# EAGLE design MagicDesk (EAGLE 7.1.0)
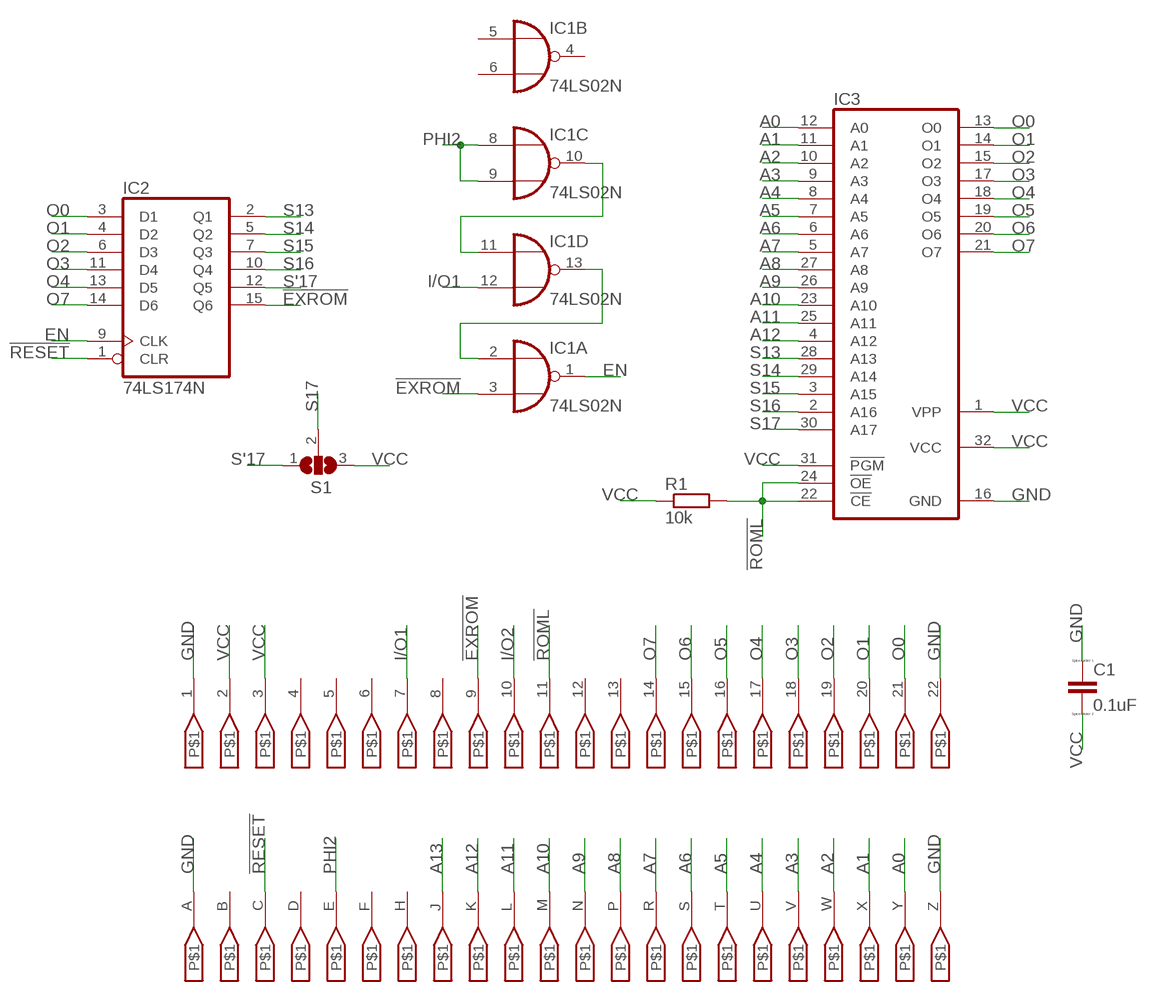
[diagram p0: schematic, sheet 1]

## Parts
C1  0.1uF  C-EU050-24X044_SP  [C050-24X044_SP]
IC1  74LS02N  [DIL14]
IC2  74LS174N  [DIL16]
IC3  27C2001D  [DIL32]
R1  10k  R-EU_0207/10_SP  [0207/10_SP]
S1  SJ2W_NUMBERED  [SJ_2_NUM]
U$1  C64_EXPANSION_FINGERS_PIN8X1.9  [C64_EXPANSION_FINGERS_THINNER]

## Nets
!EXROM: IC1.3(A:I1) IC2.15(Q6) U$1.9
!RESET: IC2.1(CLR) U$1.C
!ROML: IC3.22(!CE) IC3.24(!OE) R1.2 U$1.11
A0: IC3.12(A0) U$1.Y
A1: IC3.11(A1) U$1.X
A2: IC3.10(A2) U$1.W
A3: IC3.9(A3) U$1.V
A4: IC3.8(A4) U$1.U
A5: IC3.7(A5) U$1.T
A6: IC3.6(A6) U$1.S
A7: IC3.5(A7) U$1.R
A8: IC3.27(A8) U$1.P
A9: IC3.26(A9) U$1.N
A10: IC3.23(A10) U$1.M
A11: IC3.25(A11) U$1.L
A12: IC3.4(A12) U$1.K
A13: U$1.J
EN: IC1.1(A:O) IC2.9(CLK)
GND: C1.1 IC3.16(GND) U$1.1 U$1.22 U$1.A U$1.Z
I/O1: IC1.12(D:I1) U$1.7
I/O2: U$1.10
N$1: IC1.2(A:I0) IC1.13(D:O)
N$3: IC1.10(C:O) IC1.11(D:I0)
O0: IC2.3(D1) IC3.13(O0) U$1.21
O1: IC2.4(D2) IC3.14(O1) U$1.20
O2: IC2.6(D3) IC3.15(O2) U$1.19
O3: IC2.11(D4) IC3.17(O3) U$1.18
O4: IC2.13(D5) IC3.18(O4) U$1.17
O5: IC3.19(O5) U$1.16
O6: IC3.20(O6) U$1.15
O7: IC2.14(D6) IC3.21(O7) U$1.14
PHI2: IC1.8(C:I0) IC1.9(C:I1) U$1.E
S13: IC2.2(Q1) IC3.28(A13)
S14: IC2.5(Q2) IC3.29(A14)
S15: IC2.7(Q3) IC3.3(A15)
S16: IC2.10(Q4) IC3.2(A16)
S17: IC3.30(A17) S1.2
S'17: IC2.12(Q5) S1.1
VCC: C1.2 IC3.1(VPP) IC3.31(!PGM) IC3.32(VCC) R1.1 S1.3 U$1.2 U$1.3
Unconnected: IC1.4(B:O) IC1.5(B:I0) IC1.6(B:I1) U$1.4 U$1.5 U$1.6 U$1.8 U$1.12 U$1.13 U$1.B U$1.D U$1.F U$1.H

## Power pins joined to a net without a drawn wire
GND: IC1.7(P:GND) IC2.8(GND)
VCC: IC1.14(P:VCC) IC2.16(VCC)

## Library data of the parts
C1 = MyCustomLibrary:C-EU: CAPACITOR, European symbol
IC1 = MyCustomLibrary:74*02: Quad 2-input NOR gate
IC2 = MyCustomLibrary:74*174: Hex D type FLIP FLOP, clear
IC3 = MyCustomLibrary:27C2001D: MEMORY; MPN: M27C2001-10B1; OC_FARNELL: 3338101; OC_NEWARK: 37M4702
R1 = MyCustomLibrary:R-EU_: RESISTOR, European symbol
S1 = MyCustomLibrary:SJ2W: SMD solder JUMPER
U$1 = MyCustomLibrary:C64_EXPANSION_FINGERS_PIN

## Board
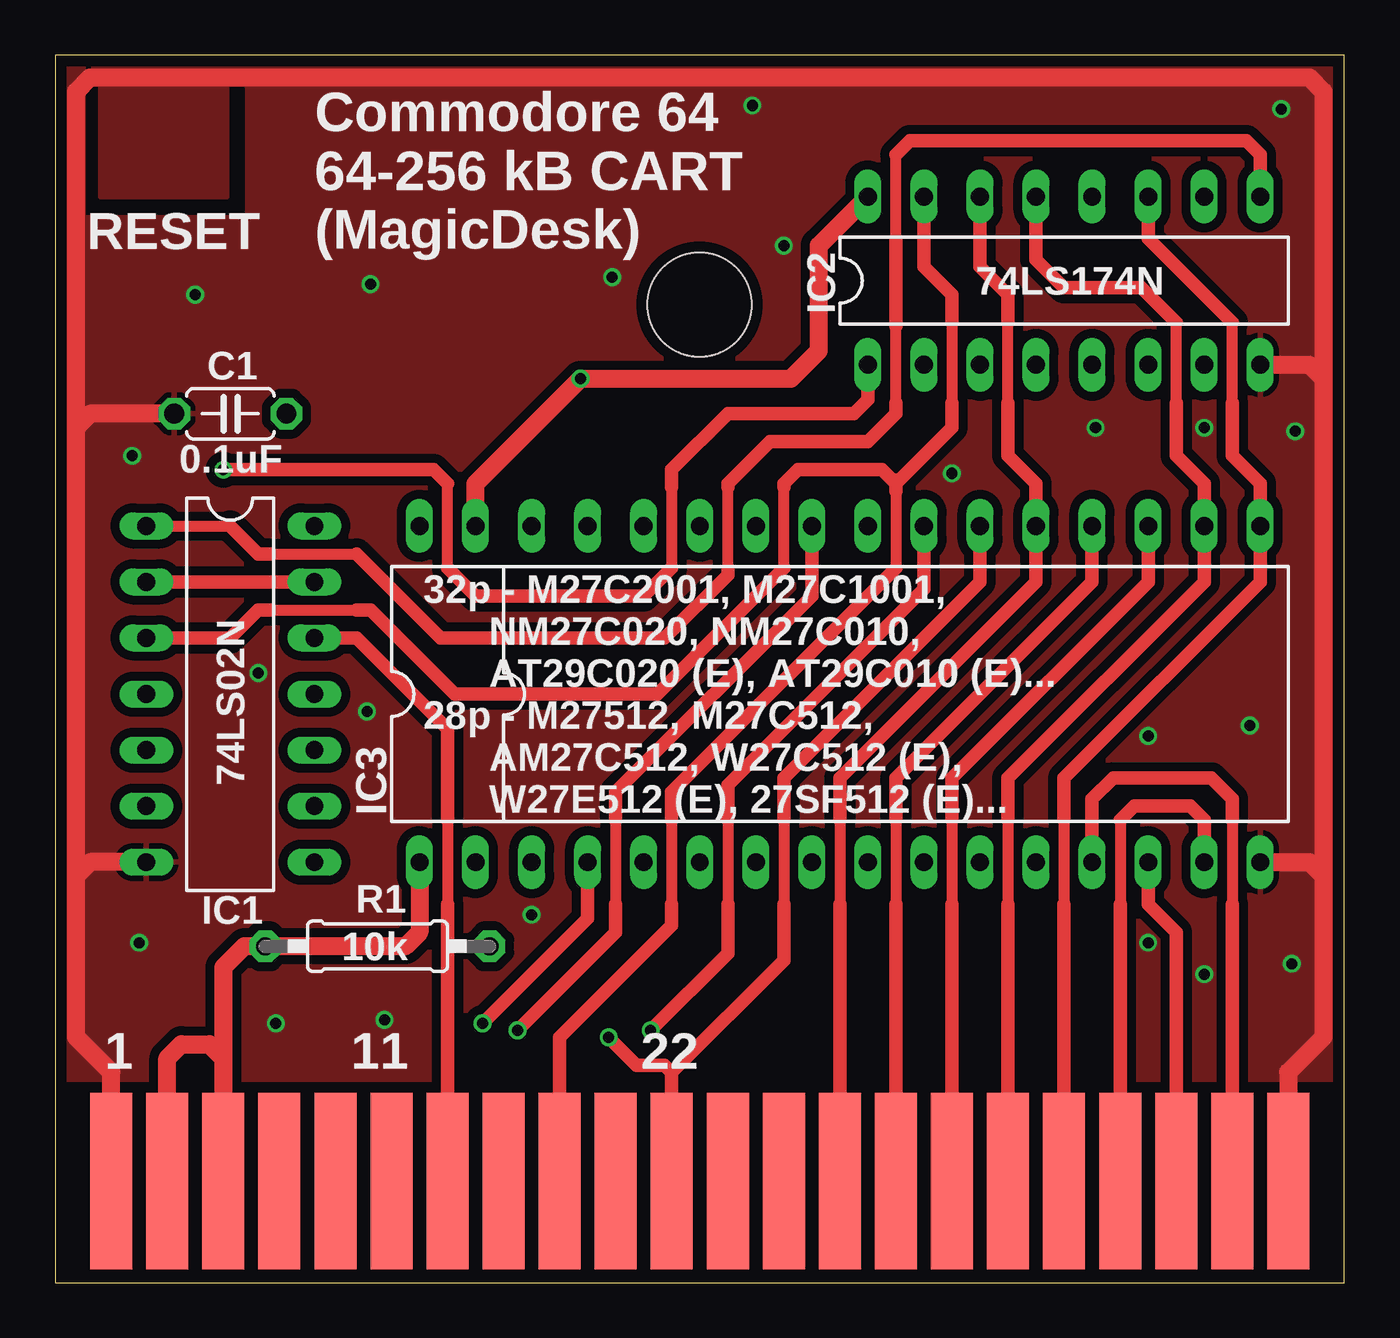
[diagram p1: board, top side]
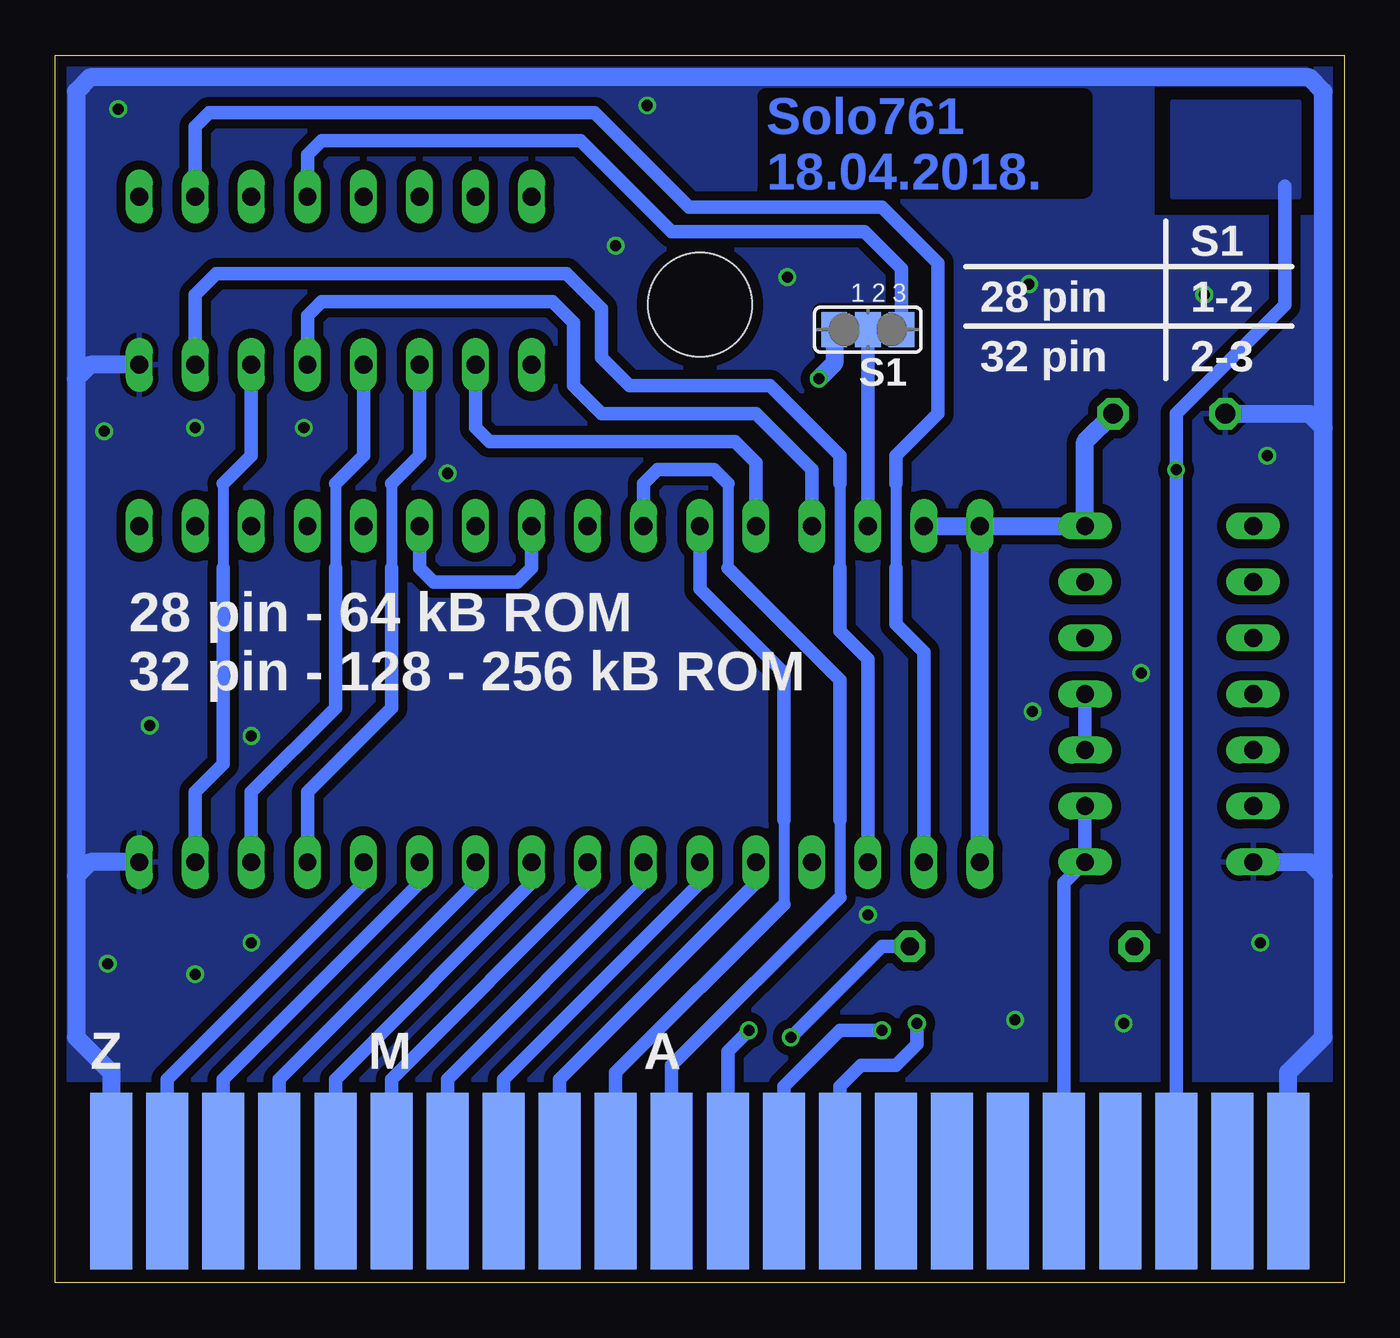
[diagram p2: board, bottom side, seen from below]

Size 58.42 x 55.62 mm. Coordinates in mm from the lower left corner, seen from the top.
Outline: 0,0 58.42,0 58.42,55.62 0,55.62 0,0
Copper layers (1*16): Top 0.035mm / dielectric 1.6mm / Bottom 0.035mm
Design rules "Custom_Elecrow_2-layer_PCB_eagle_rule": minimum track width 6mil, minimum drill 12mil, track to track 16mil, track to pad 16mil, pad to pad 12mil, via to via 12mil, smd to smd 0mil, copper to edge 20mil, drill to drill 10mil, minimum pad ring 6mil, minimum via ring 6mil, stop-mask expansion 0mil, vias tented up to drill 100mil, thermal gap 10mil
Holes 4.7 mm at 29.2,44.31

### Footprints (pad centres in the part's own frame; a part is rotated, then mirrored left to right if it is on the bottom)
C050-24X044_SP = drill 0.9 pad 1.422 octagon: 1 -2.54,0; 2 2.54,0
DIL14 = drill 0.813 long: 1 -7.62,-3.81; 2 -5.08,-3.81; 3 -2.54,-3.81; 4 0,-3.81; 5 2.54,-3.81; 6 5.08,-3.81; 7 7.62,-3.81; 8 7.62,3.81; 9 5.08,3.81; 10 2.54,3.81; 11 0,3.81; 12 -2.54,3.81; 13 -5.08,3.81; 14 -7.62,3.81
DIL16 = drill 0.813 long: 1 -8.89,-3.81; 2 -6.35,-3.81; 3 -3.81,-3.81; 4 -1.27,-3.81; 5 1.27,-3.81; 6 3.81,-3.81; 7 6.35,-3.81; 8 8.89,-3.81; 9 8.89,3.81; 10 6.35,3.81; 11 3.81,3.81; 12 1.27,3.81; 13 -1.27,3.81; 14 -3.81,3.81; 15 -6.35,3.81; 16 -8.89,3.81
DIL32 = drill 0.813 long: 1 -19.05,-7.62; 2 -16.51,-7.62; 3 -13.97,-7.62; 4 -11.43,-7.62; 5 -8.89,-7.62; 6 -6.35,-7.62; 7 -3.81,-7.62; 8 -1.27,-7.62; 9 1.27,-7.62; 10 3.81,-7.62; 11 6.35,-7.62; 12 8.89,-7.62; 13 11.43,-7.62; 14 13.97,-7.62; 15 16.51,-7.62; 16 19.05,-7.62; 17 19.05,7.62; 18 16.51,7.62; 19 13.97,7.62; 20 11.43,7.62; 21 8.89,7.62; 22 6.35,7.62; 23 3.81,7.62; 24 1.27,7.62; 25 -1.27,7.62; 26 -3.81,7.62; 27 -6.35,7.62; 28 -8.89,7.62; 29 -11.43,7.62; 30 -13.97,7.62; 31 -16.51,7.62; 32 -19.05,7.62
0207/10_SP = drill 0.813 pad 1.422 octagon: 1 -5.08,0; 2 5.08,0
SJ_2_NUM = smd 1.168 x 1.6: 1 -1.524,0; 2 0,0; 3 1.524,0
C64_EXPANSION_FINGERS_THINNER = smd 1.9 x 8: 1 -25.4,0; 2 -22.86,0; 3 -20.32,0; 4 -17.78,0; 5 -15.24,0; 6 -12.7,0; 7 -10.16,0; 8 -7.62,0; 9 -5.08,0; 10 -2.54,0; 11 0,0; 12 2.54,0; 13 5.08,0; 14 7.62,0; 15 10.16,0; 16 12.7,0; 17 15.24,0; 18 17.78,0; 19 20.32,0; 20 22.86,0; 21 25.4,0; 22 27.94,0 | smd 1.9 x 8 bottom: A -25.4,0; B -22.86,0; C -20.32,0; D -17.78,0; E -15.24,0; F -12.7,0; H -10.16,0; J -7.62,0; K -5.08,0; L -2.54,0; M 0,0; N 2.54,0; P 5.08,0; R 7.62,0; S 10.16,0; T 12.7,0; U 15.24,0; V 17.78,0; W 20.32,0; X 22.86,0; Y 25.4,0; Z 27.94,0

### Placement (x,y rotation side)
C1  7.94,39.37 0 top
IC1  7.94,26.67 270 top
IC2  45.72,45.4 0 top
IC3  35.56,26.67 0 top
R1  14.61,15.24 0 top
S1  21.59,43.18 180 bottom
U$1  27.94,4.6 0 top
U$2  [COMMODORE_SIGN]  18.41,41.59 0 top

### Tracks (layer width: path | path; a pad name or v marks a point on that pad's centre or on a via)
!EXROM
  Top 0.508: 40.64,44.77 40.64,44.61 | 40.64,43.5 40.64,39.85 | 40.64,38.89 40.64,38.73 | 38.1,36.2 38.1,35.88 38.1,32.38 | 27.94,20.95 27.94,17.14 | 27.94,16.35 27.94,16.19 | 9.84,30.48 13.65,30.48 | 33.02,32.38 33.02,36.04
  Top 0.61: IC2.15 39.37,46.04 40.64,44.77 | 40.64,38.73 38.1,36.2 37.47,36.83 33.66,36.83 33.02,36.2 33.02,36.04 | 38.1,32.38 27.94,22.23 27.94,20.95 | 27.94,16.19 22.86,11.11 U$1.9 | IC1.3 7.94,29.21 9.21,30.48 9.84,30.48 | 33.02,32.38 27.3,26.67 18.1,26.67 14.29,30.48 13.65,30.48 | 27.94,16.35 27.94,17.14 | 38.1,36.35 38.1,35.88 | 40.64,44.61 40.64,43.5 | 40.64,38.89 40.64,39.85
!RESET  (via drill 0.5)
  Top 0.508: 27.94,36.2 27.94,36.04 27.94,32.38 | 17.78,32.38 17.78,36.2
  Top 0.61: IC2.1 36.83,40.01 36.2,39.37 30.48,39.37 27.94,36.83 27.94,36.67 | 27.94,32.38 26.67,31.11 19.05,31.11 17.78,32.38 | 17.78,36.2 17.14,36.83 v7.62,36.83 | 27.94,36.67 27.94,36.2 | 27.94,36.67 27.94,36.04
  Bottom 0.61: U$1.C v7.62,36.83 7.62,39.37 2.7,44.29 2.7,49.69
  pour Bottom: 2.06,53.5 2.06,49.21 7.78,49.21 7.78,53.5
!ROML  (via drill 0.5)
  Top 0.508: 33.02,20.95 33.02,17.14
  Top 0.61: IC3.22 41.91,31.75 33.02,22.86 33.02,20.95 | 27.94,9.53 33.02,14.61 33.02,17.14 | 27.94,9.53 U$1.11 | 27.94,9.53 27.62,9.84 26.35,9.84 v25.08,11.11
  Bottom 0.61: IC3.22 41.91,32.38 41.27,31.75 37.47,31.75 36.83,32.38 IC3.24 | v25.08,11.11 20.95,15.24 R1.2
A0
  Bottom 0.61: IC3.12 44.45,18.1 53.34,9.21 U$1.Y
A1
  Bottom 0.61: IC3.11 41.91,18.1 50.8,9.21 U$1.X
A2
  Bottom 0.61: IC3.10 39.37,18.1 48.26,9.21 U$1.W
A3
  Bottom 0.61: IC3.9 36.83,18.1 45.72,9.21 U$1.V
A4
  Bottom 0.61: IC3.8 34.29,18.1 43.18,9.21 U$1.U
A5
  Bottom 0.61: IC3.7 31.75,18.1 40.64,9.21 U$1.T
A6
  Bottom 0.61: IC3.6 29.21,18.1 38.1,9.21 U$1.S
A7
  Bottom 0.61: IC3.5 26.67,18.1 35.56,9.21 U$1.R
A8
  Bottom 0.508: 25.4,20.95 25.4,17.14
  Bottom 0.61: IC3.27 29.21,31.43 25.4,27.62 25.4,20.95 | 25.4,17.14 33.02,9.53 U$1.P
A9
  Bottom 0.508: 27.94,36.2 27.94,32.38 | 22.86,20.95 22.86,17.46
  Bottom 0.61: IC3.26 31.75,36.2 31.11,36.83 28.57,36.83 27.94,36.2 | 27.94,32.38 22.86,27.3 22.86,20.95 | 22.86,17.46 30.48,9.84 U$1.N
A10  (via drill 0.5)
  Top 0.508: 30.48,20.95 30.48,17.14
  Top 0.61: IC3.23 39.37,31.43 30.48,22.54 30.48,20.95 | v26.99,11.43 30.48,14.92 30.48,17.14
  Bottom 0.61: U$1.M 27.94,10.48 v26.99,11.43
A11  (via drill 0.5)
  Top 0.508: 25.4,20.95 25.4,17.14
  Top 0.61: IC3.25 34.29,31.11 25.4,22.23 25.4,20.95 | v20.95,11.43 25.4,15.88 25.4,16.99 25.4,17.14
  Bottom 0.61: U$1.L 25.4,8.89 22.86,11.43 v20.95,11.43
A12  (via drill 0.5)
  Top 0.61: IC3.4 24.13,16.51 v19.37,11.75
  Bottom 0.61: U$1.K 22.86,8.89 21.91,9.84 20.32,9.84 19.37,10.79 v19.37,11.75
EN
  Top 0.508: IC1.1 7.94,34.29 | 9.84,33.02 13.65,33.02 | 30.48,32.38 30.48,36.04 | 38.1,39.85 38.1,43.34 | 38.1,47.31 38.1,51.12
  Top 0.61: 7.94,34.29 9.21,33.02 9.84,33.02 | 13.65,33.02 17.46,29.21 27.62,29.21 30.48,32.07 30.48,32.38 | 38.1,51.12 38.73,51.75 53.98,51.75 54.61,51.12 IC2.9 | 30.48,36.04 30.48,36.2 32.38,38.1 36.83,38.1 38.1,39.37 38.1,39.85 | 38.1,43.34 38.1,47.31
GND  (via drill 0.5)
  Top 0.813: U$1.A 2.54,9.53 0.95,11.11 0.95,18.41 | 0.95,18.41 0.95,38.73 | 0.95,38.73 0.95,53.98 1.59,54.61 56.83,54.61 57.47,53.98 57.47,40.96 | 57.47,40.96 57.47,18.41 | 57.47,18.41 57.47,11.11 55.88,9.53 U$1.Z | IC3.16 56.83,19.05 57.47,18.41 | IC2.8 56.83,41.59 57.47,40.96 | IC1.7 1.59,19.05 0.95,18.41 | C1.1 1.59,39.37 0.95,38.73
  Bottom 0.813: U$1.A 2.54,9.53 0.95,11.11 0.95,18.41 | 0.95,18.41 0.95,38.73 | 0.95,38.73 0.95,53.98 1.59,54.61 56.83,54.61 57.47,53.98 57.47,40.96 | 57.47,40.96 57.47,18.41 | 57.47,18.41 57.47,11.11 55.88,9.53 U$1.Z | IC3.16 56.83,19.05 57.47,18.41 | IC2.8 56.83,41.59 57.47,40.96 | IC1.7 1.59,19.05 0.95,18.41 | C1.1 1.59,39.37 0.95,38.73
  other vias: 6.35,44.77 3.81,15.4 3.49,37.47 10,11.75 14.92,11.91 21.59,16.67 40.64,36.67 47.15,38.73 52.07,13.97 49.53,15.4 52.07,38.73 49.53,24.77 54.13,25.24 56.04,14.45 56.2,38.58 25.24,45.56 31.59,53.34 14.29,45.24 55.56,53.18 9.21,27.62 33.02,46.99 14.13,25.88
  pour Top: 2.06,54.45 2.06,49.21 7.78,49.21 7.78,54.45
  pour Top: 0.32,9.21 0.32,55.24 1.27,55.24 1.27,48.26 8.73,48.26 8.73,54.29 1.75,54.29 1.75,55.24 58.1,55.24 58.1,9.21
  pour Bottom: 0.32,55.24 1.27,55.24 1.27,48.26 8.73,48.26 8.73,54.29 1.75,54.29 1.75,55.24 58.1,55.24 58.1,9.21 0.32,9.21
I/O1
  Top 0.508: 17.78,20.95 17.78,17.14 | 17.78,6.83 U$1.7
  Top 0.61: IC1.12 13.65,29.21 17.78,25.08 17.78,20.95 | 17.78,17.14 17.78,6.83
N$1
  Top 0.61: IC1.2 IC1.13
N$3
  Bottom 0.61: IC1.11 IC1.10
O0
  Top 0.508: 53.34,21.91 53.34,21.75 | 53.34,20.95 53.34,17.14 | 53.34,6.67 U$1.21
  Top 0.61: IC3.13 46.99,21.91 47.94,22.86 52.39,22.86 53.34,21.91 | 53.34,17.14 53.34,6.67 | 53.34,21.75 53.34,20.95
  Bottom 0.508: 43.18,36.2 43.18,32.38 43.18,32.23
  Bottom 0.61: IC2.3 41.91,37.47 43.18,36.2 | IC3.13 46.99,22.23 43.18,26.04 43.18,31.27 43.18,32.23 43.18,32.38
O1
  Top 0.61: IC3.14 49.53,17.14 50.8,15.88 U$1.20
  Bottom 0.508: 45.72,36.2 45.72,32.38
  Bottom 0.61: IC2.4 44.45,37.47 45.72,36.2 | IC3.14 49.53,22.23 45.72,26.04 45.72,32.38
O2
  Top 0.508: 48.26,20.95 48.26,17.14 | 48.26,7.3 U$1.19
  Top 0.61: IC3.15 52.07,20.95 51.44,21.59 48.9,21.59 48.26,20.95 | 48.26,17.14 48.26,7.3
  Bottom 0.508: 50.8,36.2 50.8,32.38
  Bottom 0.61: IC2.6 49.53,37.47 50.8,36.2 | IC3.15 52.07,22.23 50.8,23.5 50.8,32.38
O3
  Top 0.508: 45.72,20.95 45.72,17.14 | 45.72,6.83 U$1.18 | 53.34,39.85 53.34,43.5
  Top 0.61: 53.34,43.5 49.53,47.31 IC2.11 | 45.72,17.14 45.72,6.83 | 45.72,20.95 45.72,22.86 54.61,31.75 IC3.17 54.61,36.2 53.34,37.47 53.34,39.85
O4
  Top 0.508: 43.18,20.95 43.18,17.14 | 43.18,7.62 U$1.17 | 50.8,39.85 50.8,43.5
  Top 0.61: 50.8,43.5 49.21,45.09 45.72,45.09 44.45,46.35 IC2.13 | 43.18,17.14 43.18,7.62 | 43.18,20.95 43.18,22.86 52.07,31.75 IC3.18 52.07,36.2 50.8,37.47 50.8,39.85
O5
  Top 0.508: 40.64,20.95 40.64,17.14 | 40.64,7.78 U$1.16
  Top 0.61: IC3.19 49.53,31.75 40.64,22.86 40.64,20.95 | 40.64,17.14 40.64,7.78
O6
  Top 0.508: 38.1,20.95 38.1,17.14 | 38.1,7.78 U$1.15
  Top 0.61: IC3.20 46.99,31.75 38.1,22.86 38.1,20.95 | 38.1,17.14 38.1,7.78
O7
  Top 0.508: 35.56,20.95 35.56,17.14 | 35.56,7.3 U$1.14 | 43.18,39.85 43.18,43.5
  Top 0.61: IC2.14 41.91,46.04 43.18,44.77 43.18,43.5 | 35.56,17.14 35.56,7.3 | 35.56,20.95 35.56,22.86 44.45,31.75 IC3.21 44.45,36.2 43.18,37.47 43.18,39.69 43.18,39.85
PHI2
  Bottom 0.61: U$1.E 12.7,18.1 IC1.8 IC1.9
S13
  Bottom 0.61: IC2.2 39.37,38.73 38.73,38.1 27.62,38.1 26.67,37.15 IC3.28
S14
  Bottom 0.61: IC2.5 46.99,43.81 46.35,44.45 35.88,44.45 34.92,43.5 34.92,40.64 33.66,39.37 26.67,39.37 24.13,36.83 IC3.29
S15
  Bottom 0.508: 22.86,37.47 22.86,37.31 | 22.86,36.2 22.86,32.38 | 22.86,29.69 22.86,29.53
  Bottom 0.61: IC2.7 52.07,44.77 51.12,45.72 35.24,45.72 33.66,44.13 33.66,41.91 32.38,40.64 26.04,40.64 22.86,37.47 | 22.86,29.53 21.59,28.26 IC3.3 | 22.86,37.31 22.86,36.2 | 22.86,29.69 22.86,32.38
S16
  Bottom 0.508: 20.32,36.2 20.32,32.38 | 20.32,30 20.32,29.84
  Bottom 0.61: IC2.10 52.07,52.39 51.44,53.02 33.97,53.02 29.69,48.74 20.95,48.74 18.41,46.2 18.41,39.37 20.32,37.47 20.32,36.2 | 20.32,29.84 19.05,28.57 IC3.2 | 20.32,30 20.32,32.38
S17
  Bottom 0.61: IC3.30 S1.2
S'17
  Bottom 0.61: IC2.12 46.99,51.12 46.35,51.75 34.61,51.75 30.48,47.62 21.75,47.62 20.07,45.94 S1.1
VCC  (via drill 0.5)
  Top 0.813: U$1.2 5.08,10.16 5.71,10.79 6.99,10.79 7.62,10.16 | 7.62,10.16 U$1.3 | IC3.1 16.51,15.88 15.88,15.24 R1.1 8.57,15.24 7.62,14.29 7.62,10.16 | IC3.31 19.05,36.2 v23.81,40.96 33.34,40.96 34.61,42.23 34.61,46.99 IC2.16
  Bottom 0.813: IC3.1 IC3.32 | IC3.32 IC1.14 11.75,38.1 C1.2 | IC3.31 IC3.32 | S1.3 23.11,41.66 v23.81,40.96

### Text on the board
Bottom: Solo761 / 18.04.2018.
tPlace: 32p - M27C2001, M27C1001, / NM27C020, NM27C010, / AT29C020 (E), AT29C010 (E)... / 28p - M27512, M27C512, / AM27C512, W27C512 (E), / W27E512 (E), 27SF512 (E)...
tNames: RESET | Commodore 64 / 64-256 kB CART / (MagicDesk) | 1 11 22
bNames: S1 | 1-2 | 28 pin | 2-3 | 32 pin | 28 pin - 64 kB ROM / 32 pin - 128 - 256 kB ROM | Z M A
bStop: Solo761 / 18.04.2018.